# EAGLE design lisa_ui (EAGLE 6.1)
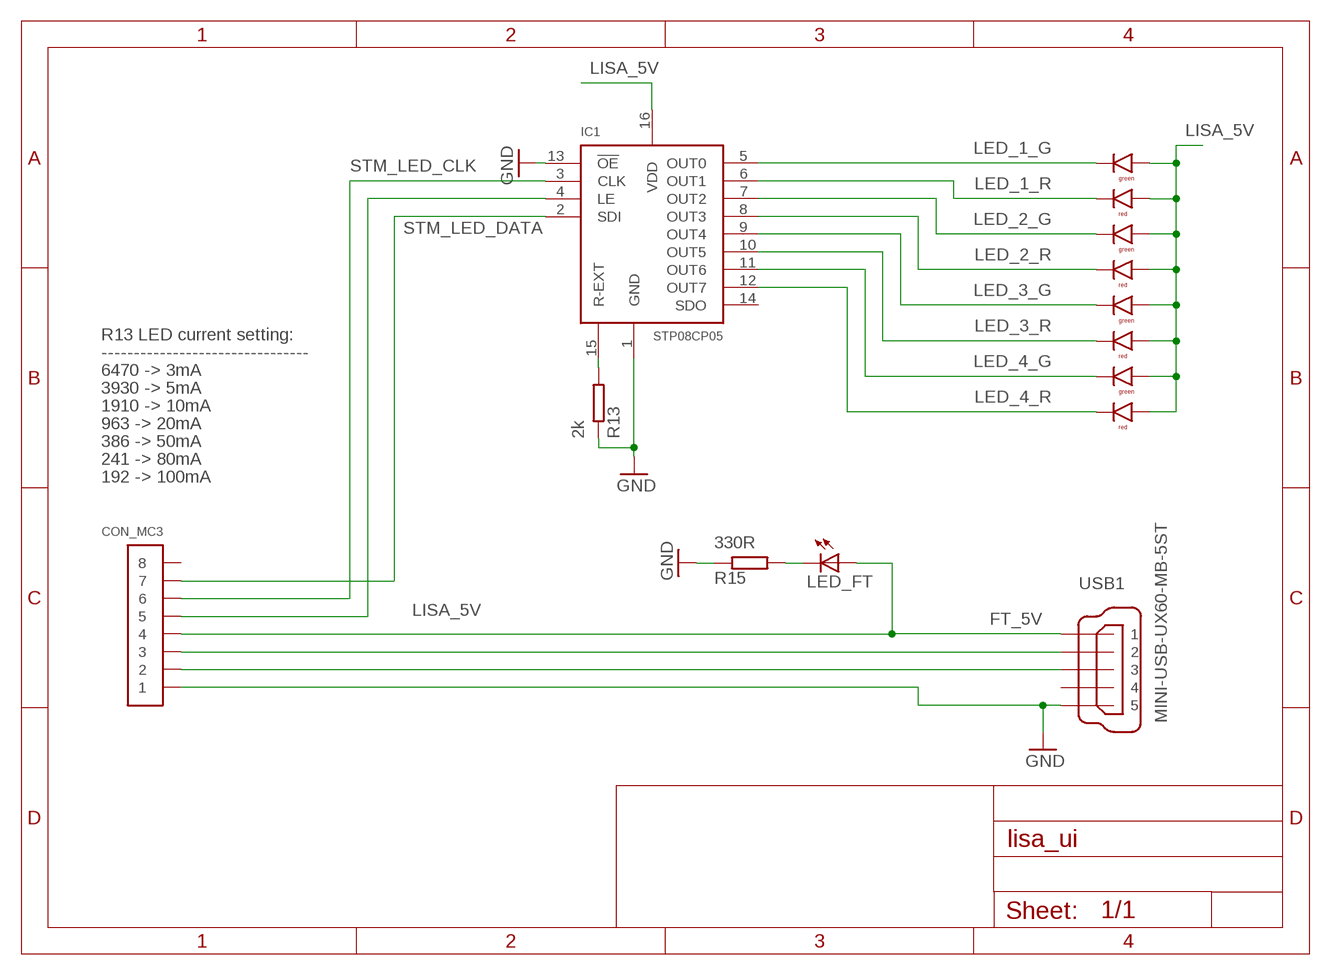
[diagram p0: schematic, sheet 1]

## Parts
CON_MC3  CONN_8-1  [PB-53261-08]
IC1  STP08CP05  [TSSOP16]
LED_1  LED_DUO  [DUO_LED]
LED_2  LED_DUO  [DUO_LED]
LED_3  LED_DUO  [DUO_LED]
LED_4  LED_DUO  [DUO_LED]
LED_FT  LED-0603  [0603-LED]
R13  2k  RESISTOR-0603  [0603-RES]
R15  330R  RESISTOR-0603  [0603-RES]
USB1  MINI-USB-UX60-MB-5ST  [UX60-MB-5ST]

## Nets
FT_5V: CON_MC3.4 LED_FT.A USB1.1
GND: CON_MC3.1 IC1.1(GND) IC1.13(!OE) R13.P$1 R15.P$1 USB1.5
LED_1_G: IC1.5(OUT0) LED_1.3
LED_1_R: IC1.6(OUT1) LED_1.2
LED_2_G: IC1.7(OUT2) LED_2.3
LED_2_R: IC1.8(OUT3) LED_2.2
LED_3_G: IC1.9(OUT4) LED_3.3
LED_3_R: IC1.10(OUT5) LED_3.2
LED_4_G: IC1.11(OUT6) LED_4.3
LED_4_R: IC1.12(OUT7) LED_4.2
LISA_5V: CON_MC3.5 IC1.4(LE) IC1.16(VDD) LED_1.1 LED_1.4 LED_2.1 LED_2.4 LED_3.1 LED_3.4 LED_4.1 LED_4.4
N$1: IC1.15(R-EXT) R13.P$2
N$16: LED_FT.C R15.P$2
N$37: CON_MC3.3 USB1.2
N$38: CON_MC3.2 USB1.3
STM_LED_CLK: CON_MC3.6 IC1.3(CLK)
STM_LED_DATA: CON_MC3.7 IC1.2(SDI)
Unconnected: CON_MC3.8 IC1.14(SDO) USB1.4

## Notes on the sheet
- R13 LED current setting:
- --------------------------------
- 6470 -> 3mA
- 3930 -> 5mA
- 1910 -> 10mA
- 963 -> 20mA
- 386 -> 50mA
- 241 -> 80mA
- 192 -> 100mA

## Library data of the parts
CON_MC3 = molex:CONN_8-1
IC1 = booz:STP08CP05
LED_1-LED_4 = paparazzi:LED_DUO
LED_FT = res_cap:LED
R13 R15 = res_cap:RESISTOR
USB1 = con-hirose:MINI-USB-: MINI USB Connector Source: http://www.hirose.co.jp/cataloge_hp/e24000019.pdf

## Board
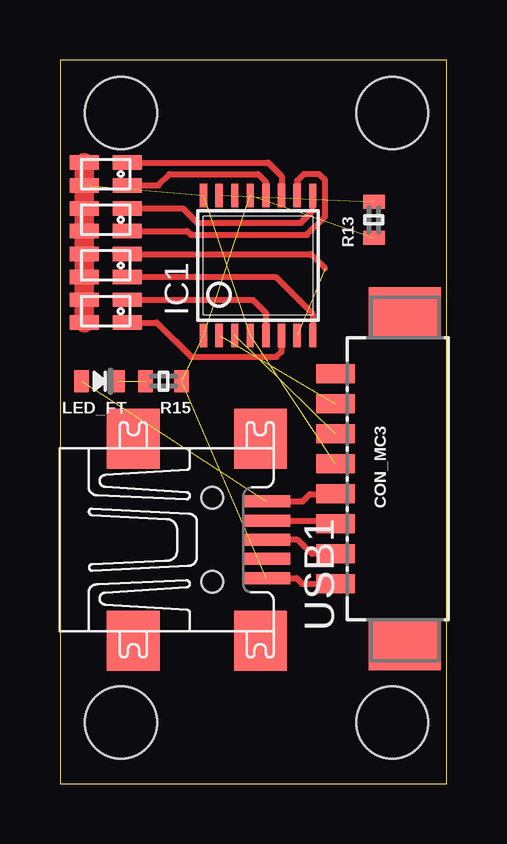
[diagram p1: board, top side]

Size 16.11 x 30.15 mm. Coordinates in mm from the lower left corner, seen from the top.
Outline: 0,0 16.11,0 16.11,30.15 0,30.15 0,0
Copper layers (1*16): Top 0.035mm / dielectric 1.5mm / Bottom 0.035mm
Design rules: minimum track width 10mil, minimum drill 24mil, track to track 8mil, track to pad 8mil, pad to pad 8mil, via to via 8mil, smd to smd 8mil, copper to edge 40mil, drill to drill 8mil, minimum pad ring 10mil, minimum via ring 8mil, stop-mask expansion 4mil, vias tented up to drill 0mil, thermal gap 10mil
Holes 3 mm at 2.54,2.54 13.84,2.54 2.54,27.94 13.84,27.94

### Footprints (pad centres in the part's own frame; a part is rotated, then mirrored left to right if it is on the bottom)
PB-53261-08 = smd 0.8 x 1.6: 1 -4.375,1.1; 2 -3.125,1.1; 3 -1.875,1.1; 4 -0.625,1.1; 5 0.625,1.1; 6 1.875,1.1; 7 3.125,1.1; 8 4.375,1.1 | smd 2.1 x 3: MNT1 -6.925,-1.8; MNT2 6.925,-1.8
TSSOP16 = smd 0.305 x 0.991: 1 -2.275,-2.918; 2 -1.625,-2.918; 3 -0.975,-2.918; 4 -0.325,-2.918; 5 0.325,-2.918; 6 0.975,-2.918; 7 1.625,-2.918; 8 2.275,-2.918; 9 2.275,2.918; 10 1.625,2.918; 11 0.975,2.918; 12 0.325,2.918; 13 -0.325,2.918; 14 -0.975,2.918; 15 -1.625,2.918; 16 -2.275,2.918
DUO_LED = smd 1.2 x 0.6: 1 0.9,0.475; 2 -0.9,0.475; 3 -0.9,-0.475; 4 0.9,-0.475
0603-LED = smd 0.6 x 0.9: A 0.75,0; C -0.75,0
0603-RES = smd 0.6 x 0.9: P$1 -0.75,0; P$2 0.75,0
UX60-MB-5ST = smd 2 x 0.5: 1 2.25,1.6; 2 2.25,0.8; 3 2.25,0; 4 2.25,-0.8; 5 2.25,-1.6 | smd 2.2 x 2.5: M1 -3.3,-4.2; M2 -3.3,4.2; M3 2,4.2; M4 2,-4.2 | hole 0.9: 0,-1.75; 0,1.75

### Placement (x,y rotation side)
CON_MC3  12.57,12.7 90 top
IC1  8.26,21.59 0 top
LED_1  1.91,19.68 180 top
LED_2  1.91,21.59 180 top
LED_3  1.91,23.5 180 top
LED_4  1.91,25.4 180 top
LED_FT  1.65,16.76 180 top
R13  13.08,23.5 90 top
R15  4.32,16.76 180 top
USB1  6.35,10.16 0 top

### Tracks (layer width: path | path; a pad name or v marks a point on that pad's centre or on a via)
FT_5V  (1 unrouted)
  Top 0.254: USB1.1 10.11,11.76 10.41,12.06 CON_MC3.4
GND  (4 unrouted)
  Top 0.254: USB1.5 9.86,8.56 10.09,8.32 CON_MC3.1
LED_1_G
  Top 0.254: LED_1.3 8.03,20.16 8.58,19.61 IC1.5
LED_1_R
  Top 0.254: LED_1.2 4.03,19.21 5.46,17.78 9.02,17.78 9.23,17.99 IC1.6
LED_2_G  (1 unrouted)
  Top 0.254: LED_2.3 10.45,22.07 11.05,21.46
LED_2_R
  Top 0.254: LED_2.2 8.98,21.11 10.53,19.57 IC1.8
LED_3_G
  Top 0.254: LED_3.3 5.11,23.97 5.71,23.37 10.03,23.37 10.53,23.86 IC1.9
LED_3_R
  Top 0.254: LED_3.2 5.3,23.02 5.46,22.86 10.29,22.86 11.05,23.62 11.05,25.15 10.79,25.4 10.16,25.4 9.88,25.12 IC1.10
LED_4_G
  Top 0.254: LED_4.3 8.67,25.88 9.23,25.31 IC1.11
LED_4_R
  Top 0.254: LED_4.2 4.1,24.93 4.57,25.4 8.26,25.4 8.58,25.07 IC1.12
LISA_5V  (3 unrouted)
  Top 0.813: LED_4.4 LED_4.1 LED_3.4 LED_3.1 LED_2.4 LED_2.1 LED_1.4 LED_1.1
N$1  (1 unrouted)
N$16  (1 unrouted)
N$37
  Top 0.254: USB1.2 11.34,10.96 CON_MC3.3
N$38
  Top 0.254: USB1.3 9.91,10.16 10.49,9.57 CON_MC3.2
STM_LED_CLK  (1 unrouted)
STM_LED_DATA  (1 unrouted)